# Altium schematic sheet SinglePhaseBoard.SchDoc
size E
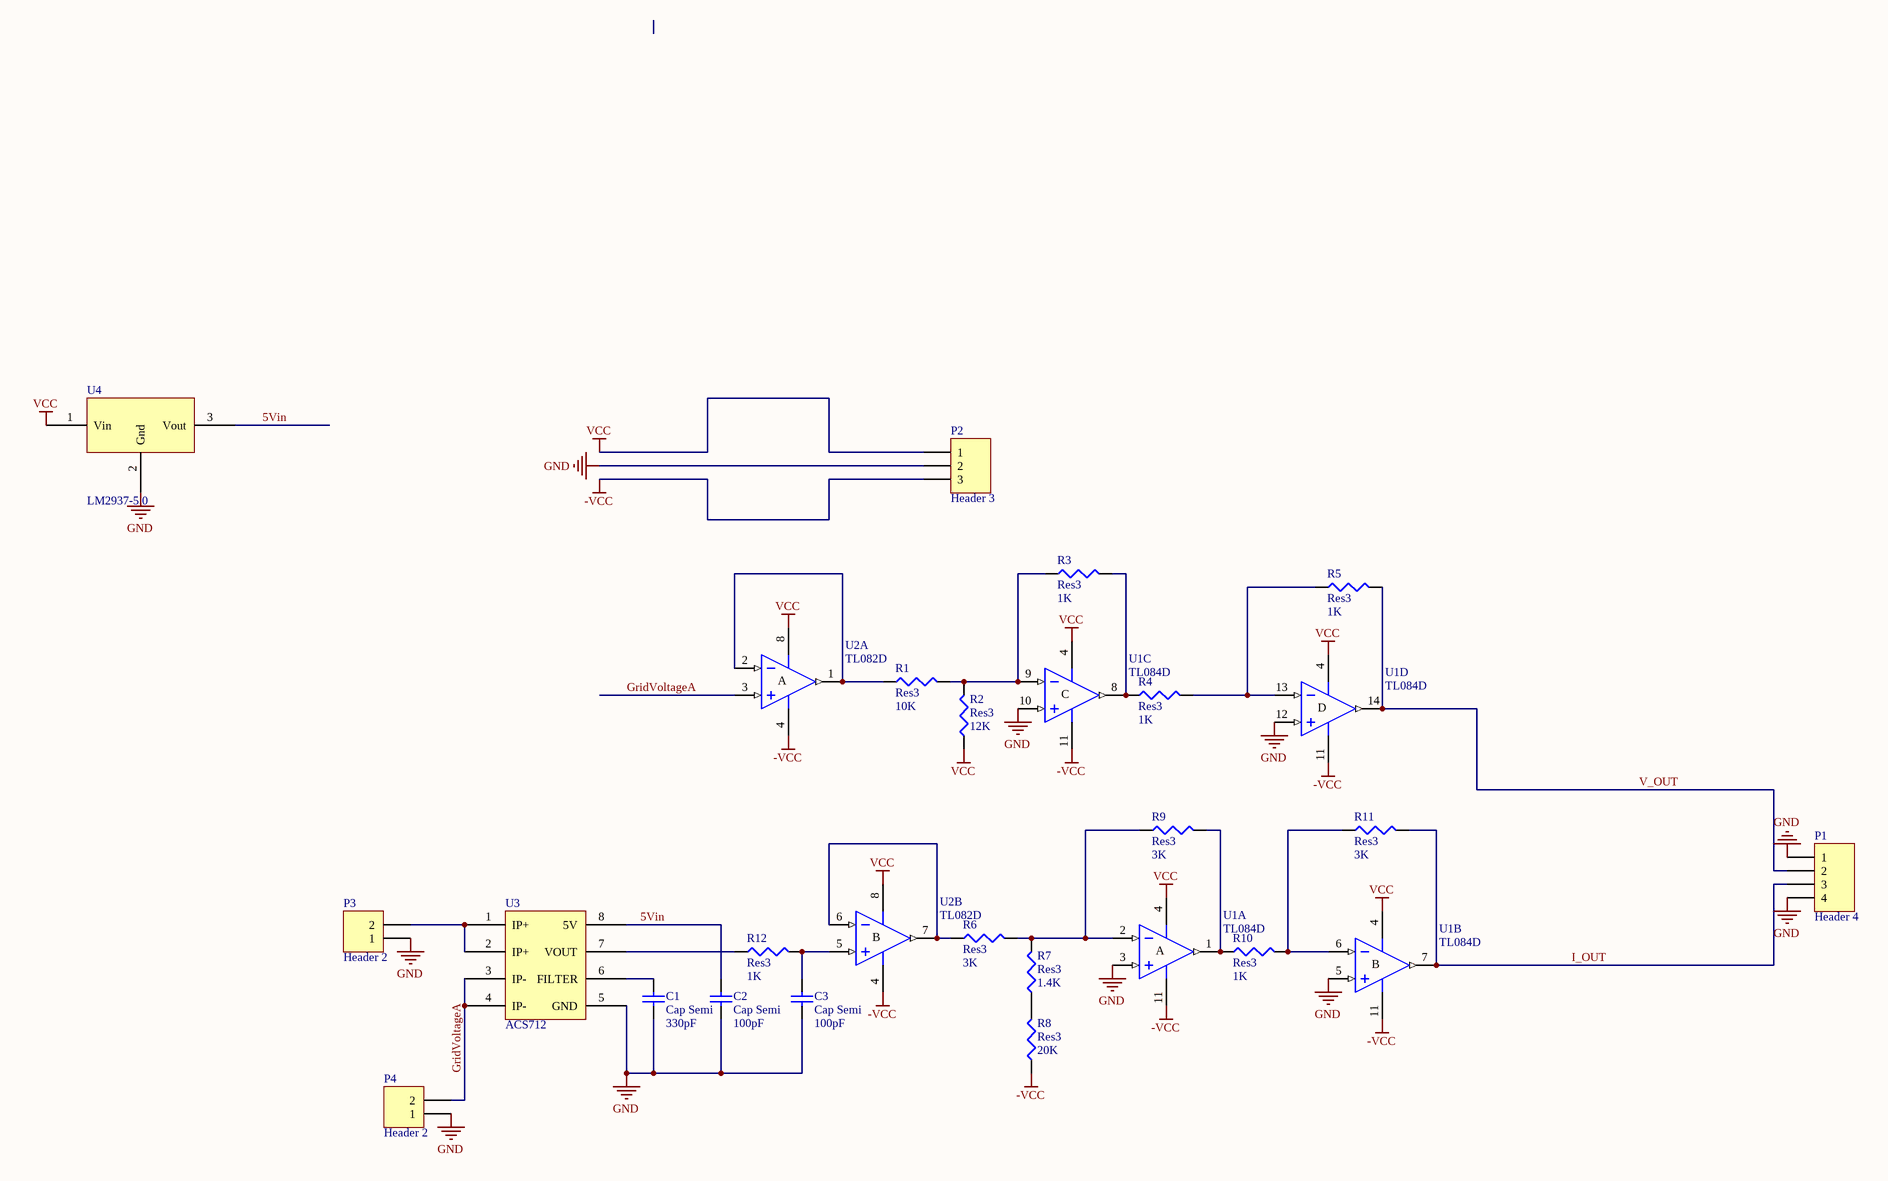
[diagram p0: SinglePhaseBoard.SchDoc]

## Parts
C1  Cap Semi  value 330pF  [CAP0805]
C2  Cap Semi  value 100pF  [CAP0402]
C3  Cap Semi  value 100pF  [CAP0402]
P1  Header 4  [HDR1X4]
P2  Header 3  [HDR1X3]
P3  Header 2  [HDR1X2]
P4  Header 2  [HDR1X2]
R1  Res3  value 10K  [RESC1608X06N]
R2  Res3  value 12K  [RESC1608X06N]
R3  Res3  value 1K  [RESC1608X06N]
R4  Res3  value 1K  [RESC1608X06N]
R5  Res3  value 1K  [RESC1608X06N]
R6  Res3  value 3K  [RESC1608X06N]
R7  Res3  value 1.4K  [RESC1608X06N]
R8  Res3  value 20K  [RESC1608X06N]
R9  Res3  value 3K  [RESC1608X06N]
R10  Res3  value 1K  [RESC1608X06N]
R11  Res3  value 3K  [RESC1608X06N]
R12  Res3  value 1K  [RESC1608X06N]
U1  TL084D  [D014_N]  (parts A,B,C,D of 4)
U2  TL082D  [D008_L]  (parts A,B of 2)
U3  ACS712  [SOIC127P620X175-8N]
U4  LM2937-5.0  [TO254P1258X464-4N]

## Nets
-VCC: P2.3 R8.1 U1.11(V-) U2.4(V-)
GND: C1.2 C2.1 C3.1 P1.1 P1.4 P2.2 P3.1 P4.1 U1.3(IN+) U1.5(IN+) U1.10(IN+) U1.12(IN+) U3.5(GND) U4.2(Gnd)
VCC: P2.1 R2.1 U1.4(V+) U2.8(V+) U4.1(Vin)
5Vin: C2.2 U3.8(5V) U4.3(Vout)
GridVoltageA: P4.2 U2.3(IN+) U3.3(IP-) U3.4(IP-)
I_OUT: P1.3 R11.2 U1.7(OUT)
V_OUT: P1.2 R5.2 U1.14(OUT)
NetC1_1: C1.1 U3.6(FILTER)
NetC3_2: C3.2 R12.2 U2.5(IN+)
NetP3_2: P3.2 U3.1(IP+) U3.2(IP+)
NetR1_1: R1.1 U2.1(OUT) U2.2(IN-)
NetR1_2: R1.2 R2.2 R3.1 U1.9(IN-)
NetR3_2: R3.2 R4.1 U1.8(OUT)
NetR4_2: R4.2 R5.1 U1.13(IN-)
NetR6_1: R6.1 U2.6(IN-) U2.7(OUT)
NetR6_2: R6.2 R7.2 R9.1 U1.2(IN-)
NetR7_1: R7.1 R8.2
NetR9_2: R9.2 R10.1 U1.1(OUT)
NetR10_2: R10.2 R11.1 U1.6(IN-)
NetR12_1: R12.1 U3.7(VOUT)

## Notes on the sheet
- (in symbol TL082D, part A) A
- (in symbol TL082D, part B) B
- (in symbol TL084D, part A) A
- (in symbol TL084D, part B) B
- (in symbol TL084D, part C) C
- (in symbol TL084D, part D) D

## Library data of the parts
C1-C3 = Cap Semi: Capacitor (Semiconductor SIM Model); Published: 8-Jun-2000; LatestRevisionDate: 29-May-2009; LatestRevisionNote: IPC-7351 Footprint Added.; PackageReference: C1206; Publisher: Altium Limited; PackageDescription: Chip Capacitor
P1 = Header 4: Header, 4-Pin; LatestRevisionDate: 17-Jul-2002; LatestRevisionNote: Re-released for DXP Platform.; Publisher: Altium Limited
P2 = Header 3: Header, 3-Pin; LatestRevisionDate: 17-Jul-2002; LatestRevisionNote: Re-released for DXP Platform.; Publisher: Altium Limited
P3 P4 = Header 2: Header, 2-Pin; LatestRevisionDate: 17-Jul-2002; LatestRevisionNote: Re-released for DXP Platform.; Publisher: Altium Limited
R1-R12 = Res3: Resistor; Published: 8-Jun-2000; LatestRevisionDate: 29-May-2009; LatestRevisionNote: IPC-7351 Footprint Added.; PackageReference: J1-0603; Publisher: Altium Limited; PackageDescription: Chip Resistor
U1 = TL084D: JFET-Input Operational Amplifier; Published: 16-Jan-2001; LatestRevisionDate: 13-Apr-2006; LatestRevisionNote: IPC-7351 Footprint Added.; DatasheetVersion: Feb-1999; PackageVersion: Jan-1998; PackageReference: D014; Publisher: Altium Limited; PackageDescription: 14-Pin Small Outline Integrated Circuit 1.27 mm Pitch; Code_IPC: SOIC127P600-14; ComponentLink1Description: Manufacturer Link; ComponentLink1URL: http://www.ti.com/; ComponentLink2Description: Datasheet; ComponentLink2URL: http://www-s.ti.com/sc/ds/tl084.pdf
U2 = TL082D: JFET-Input Operational Amplifier; Published: 16-Jan-2001; LatestRevisionDate: 13-Apr-2006; LatestRevisionNote: IPC-7351 Footprint Added.; DatasheetVersion: Feb-1999; PackageVersion: Jan-1998; PackageReference: D008; Publisher: Altium Limited; PackageDescription: 8-Pin Small Outline Integrated Circuit 1.27 mm Pitch; Code_IPC: SOIC127P600-8; ComponentLink1Description: Manufacturer Link; ComponentLink1URL: http://www.ti.com/; ComponentLink2Description: Datasheet; ComponentLink2URL: http://www-s.ti.com/sc/ds/tl082.pdf
U4 = LM2937-5.0: 5V voltage regulator